# Altium schematic sheet AD7298 12-Bit SPI ADC.SchDoc
size Letter; DocumentNumber: 2; SheetNumber: 2; SheetTotal: 2; CopyrightYear: 2019
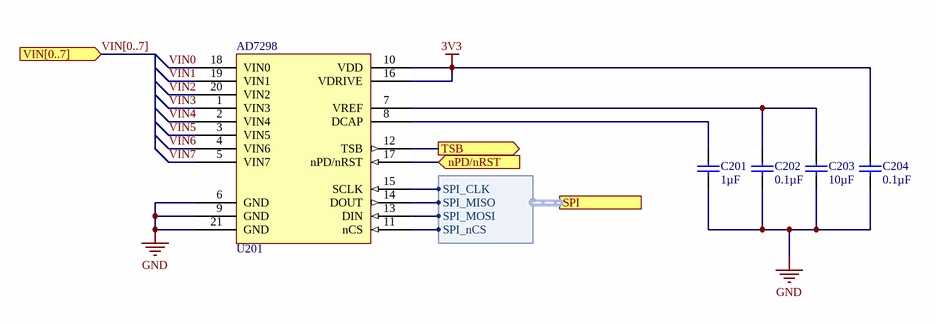
[diagram p0: AD7298 12-Bit SPI ADC.SchDoc]

## Parts
C201  value 1µF  [TDK-CGA3E]
C202  value 0.1µF  [TDK-CGA2B]
C203  value 10µF  [TDK-CGA5L]
C204  value 0.1µF  [TDK-CGA2B]
U201  AD7298  [ADI-CP-20-8]

## Ports
nPD/nRST (in), SPI (harness AD7298_SPI), TSB (out), VIN[0..7] (in)

## Harnesses
AD7298_SPI: SPI_MOSI, SPI_MISO, SPI_CLK, SPI_nCS

## Nets
3V3: C204.1 U201.10(VDD) U201.16(VDRIVE)
GND: C201.1 C202.2 C203.2 C204.2 U201.6(GND) U201.9(GND) U201.21(GND)
nPD/nRST: U201.17(nPD/nRST) ; port nPD/nRST
TSB: U201.12(TSB) ; port TSB
VIN0: U201.18(VIN0)
VIN1: U201.19(VIN1)
VIN2: U201.20(VIN2)
VIN3: U201.1(VIN3)
VIN4: U201.2(VIN4)
VIN5: U201.3(VIN5)
VIN6: U201.4(VIN6)
VIN7: U201.5(VIN7)
NetC201_2: C201.2 U201.8(DCAP)
NetC202_1: C202.1 C203.1 U201.7(VREF)
NetU201_11: U201.11(nCS) ; port SPI.SPI_nCS
NetU201_13: U201.13(DIN) ; port SPI.SPI_MOSI
NetU201_14: U201.14(DOUT) ; port SPI.SPI_MISO
NetU201_15: U201.15(SCLK) ; port SPI.SPI_CLK

## Buses and harness runs
bus VIN[0..7] = port VIN[0..7]

## Notes on the sheet
- (the "License"); you may not use or redistribute this file except in compliance with the License. You
- This file and the information within it are licensed under the terms of the Apache License, Version 2.0
- Copyright
- Unless required by applicable law or agreed to in writing, content distributed under the License is
- distributed on an "AS IS" BASIS, WITHOUT WARRANTIES OR CONDITIONS OF ANY KIND,
- either express or implied. See the License for the specific language governing permissions and
- limitations under the License.
- may obtain a copy of the License at:
- http://www.apache.org/licenses/LICENSE-2.0
- Title
- Size:
- Date:
- Letter
- Number:
- Time:
- Revision:
- Sheet
- of
- University of Alberta
- Deptartment of Electrical
- and Computer Engineering
- Edmonton AB, Canada
- T6G 1H9
- File:

## Library data of the parts
C201 = PC-TDK-02603: CAP CER 1UF 25V X7R 0603; Manufacturer Part Number: CGA3E1X7R1E105K080AC; Index: 2603; Tolerance: ±10%; Designator: C?; Published: 3/16/2016; LatestRevisionDate: 3/16/2016; LatestRevisionNote: ...; PackageReference: 0603 (1608 Metric); Publisher: AlbertaSat; Part Number: PC-TDK-02603; Supplier Part Number 1: 445-6931-1-ND; Supplier 1: Digi-key; Supplier Link: http://www.digikey.ca/product-search/en?keywords=445-6931-1-ND; Voltage - Rated: 25V; Temperature Coefficient: X7R; Applications: Automotive
C202 C204 = PC-TDK-02259: CAP CER 0.1UF 50V X7R 0402; Manufacturer Part Number: CGA2B3X7R1H104K050BB; Index: 2259; Tolerance: ±10%; Designator: C?; Published: 3/16/2016; LatestRevisionDate: 3/16/2016; LatestRevisionNote: ...; PackageReference: 0402 (1005 Metric); Publisher: AlbertaSat; Part Number: PC-TDK-02259; Supplier Part Number 1: 445-6899-1-ND; Supplier 1: Digi-key; Supplier Link: http://www.digikey.ca/product-search/en?keywords=445-6899-1-ND; Voltage - Rated: 50V; Temperature Coefficient: X7R; Applications: Automotive
C203 = PC-TDK-02917: CAP CER 10UF 25V X7R 1206; Manufacturer Part Number: CGA5L1X7R1E106K160AC; Index: 2917; Tolerance: ±10%; Designator: C?; Published: 3/16/2016; LatestRevisionDate: 3/16/2016; LatestRevisionNote: ...; PackageReference: 1206 (3216 Metric); Publisher: AlbertaSat; Part Number: PC-TDK-02917; Supplier Part Number 1: 445-6990-1-ND; Supplier 1: Digi-key; Supplier Link: http://www.digikey.ca/product-search/en?keywords=445-6990-1-ND; Voltage - Rated: 25V; Temperature Coefficient: X7R; Applications: Automotive
U201 = PU-ADI-00007: IC ADC 12BIT SAR 20LFCSP-WQ; Manufacturer Part Number: AD7298BCPZ; Index: 7; Designator: U?; Part Number: PU-ADI-00007; Supplier Part Number 1: AD7298BCPZ-ND; Supplier 1: Digi-key; Supplier Part Number 2: 584-AD7298BCPZ; Supplier 2: Mouser; Publisher: AlbertaSat; Published: 7/16/2019; LatestRevisionDate: 7/16/2019; LatestRevisionNote: ...; PackageReference: 20-WFQFN Exposed Pad; PackageDescription: QFN, 20-Leads, Body 4.00x4.00mm, Pitch 0.50mm, Thermal Pad 2.55x2.55mm, IPC Low Density; Supplier Link: #https://www.digikey.ca/product-detail/en/analog-devices-inc/AD7298BCPZ/AD7298BCPZ-ND/2507320#